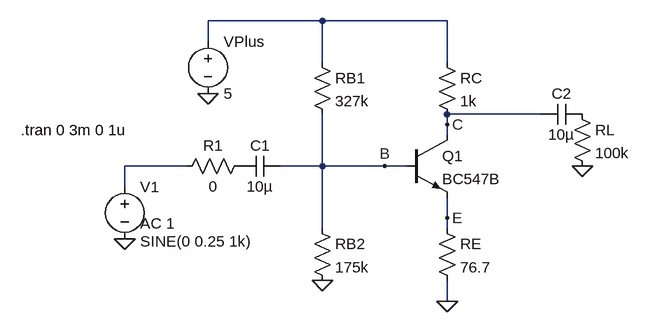
[diagram p0: schematic 2_2_d.asc]
2_2_d.asc, the LTspice schematic file:
Version 4.1
SHEET 1 880 680
WIRE 240 16 64 16
WIRE 432 16 240 16
WIRE 64 48 64 16
WIRE 240 80 240 16
WIRE 432 80 432 16
WIRE 576 160 432 160
WIRE 432 176 432 160
WIRE 432 192 432 176
WIRE 32 240 -64 240
WIRE 240 240 240 160
WIRE 240 240 176 240
WIRE 336 240 240 240
WIRE 368 240 336 240
WIRE -64 272 -64 240
WIRE 432 320 432 288
WIRE 240 336 240 240
WIRE 432 336 432 320
WIRE 432 448 432 416
FLAG 64 128 0
FLAG -64 352 0
FLAG 240 416 0
FLAG 432 448 0
FLAG 640 240 0
FLAG 432 176 C
FLAG 336 240 B
FLAG 432 320 E
SYMBOL voltage 64 32 R0
SYMATTR InstName VPlus
SYMATTR Value 5
SYMBOL voltage -64 256 R0
WINDOW 3 24 100 Left 2
WINDOW 123 24 72 Left 2
WINDOW 39 0 0 Left 0
SYMATTR InstName V1
SYMATTR Value SINE(0 0.25 1k)
SYMATTR Value2 AC 1
SYMBOL npn 368 192 R0
SYMATTR InstName Q1
SYMATTR Value BC547B
SYMBOL res 224 64 R0
SYMATTR InstName RB1
SYMATTR Value 327k
SYMBOL res 224 320 R0
SYMATTR InstName RB2
SYMATTR Value 175k
SYMBOL res 416 64 R0
SYMATTR InstName RC
SYMATTR Value 1k
SYMBOL res 624 144 R0
SYMATTR InstName RL
SYMATTR Value 100k
SYMBOL res 416 320 R0
SYMATTR InstName RE
SYMATTR Value 76.7
SYMBOL res 128 224 R90
WINDOW 0 0 56 VBottom 2
WINDOW 3 32 56 VTop 2
SYMATTR InstName R1
SYMATTR Value 0
SYMBOL cap 176 224 R90
WINDOW 0 0 32 VBottom 2
WINDOW 3 32 32 VTop 2
SYMATTR InstName C1
SYMATTR Value 10µ
SYMBOL cap 640 144 R90
WINDOW 0 0 32 VBottom 2
WINDOW 3 32 32 VTop 2
SYMATTR InstName C2
SYMATTR Value 10µ
TEXT -224 184 Left 2 !.tran 0 3m 0 1u

The netlist it stands for:
* 2_2_d.asc
VPlus N001 0 5
V1 N002 0 SINE(0 0.25 1k) AC 1
Q1 C B E 0 BC547B
RB1 N001 B 327k
RB2 B 0 175k
RC N001 C 1k
RL P001 0 100k
RE E 0 76.7
R1 P002 N002 0
C1 B P002 10µ
C2 P001 C 10µ
.model NPN NPN
.model PNP PNP
.lib standard.bjt
.tran 0 3m 0 1u
.backanno
.end